# Altium schematic sheet Sheet2.SchDoc
size A4; SheetNumber: 1; SheetTotal: 1
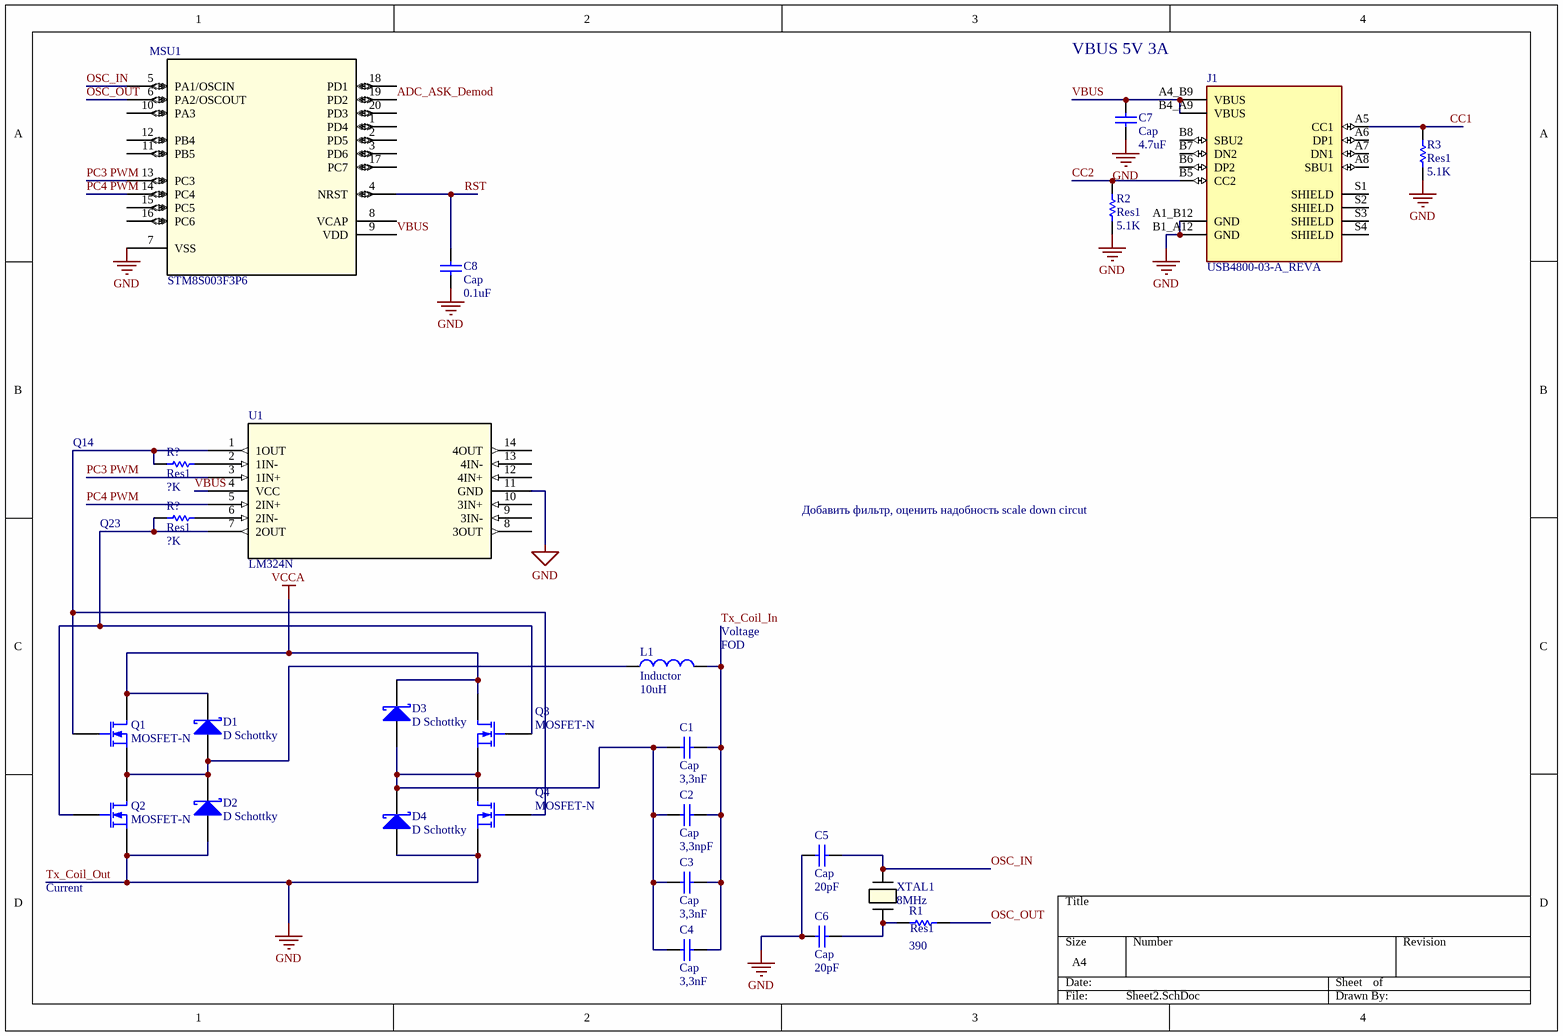
[diagram p0: Sheet2.SchDoc]

## Parts
(Parts that share a designator on the sheet are numbered #1, #2 ... from top to bottom, then left to right.)
C1  Cap  value 3,3nF  [RAD-0.3]
C2  Cap  value 3,3npF  [RAD-0.3]
C3  Cap  value 3,3nF  [RAD-0.3]
C4  Cap  value 3,3nF  [RAD-0.3]
C5  Cap  value 20pF  [RAD-0.3]
C6  Cap  value 20pF  [RAD-0.3]
C7  Cap  value 4.7uF  [RAD-0.3]
C8  Cap  value 0.1uF  [RAD-0.3]
D1  D Schottky  [SMB]
D2  D Schottky  [SMB]
D3  D Schottky  [SMB]
D4  D Schottky  [SMB]
J1  USB4800-03-A_REVA  [GCT_USB4800-03-A_REVA]
L1  Inductor  value 10uH  [0402-A]
MSU1  STM8S003F3P6  [TSSOP20]
Q1  MOSFET-N  [E3]
Q2  MOSFET-N  [E3]
Q3  MOSFET-N  [E3]
Q4  MOSFET-N  [E3]
R1  Res1  value 390  [AXIAL-0.3]
R2  Res1  value 5.1K  [AXIAL-0.3]
R3  Res1  value 5.1K  [AXIAL-0.3]
R?#1  Res1  value ?K  [AXIAL-0.3]
R?#2  Res1  value ?K  [AXIAL-0.3]
U1  LM324N  [N14]
XTAL1  8MHz  [CRYSTAL_ECS-80-18-5PX-TR_ECS]

## Nets
Tx_Coil_Out: C5.2 C6.2 C7.1 C8.1 D2.1(A) D4.1(A) J1.A1_B12(GND) J1.B1_A12(GND) MSU1.7(VSS) Q2.3(S) Q4.3(S) R2.2 R3.2 U1.11(GND)  [also labelled GND]
VCCA: D1.2(K) D3.2(K) Q1.1(D) Q3.1(D)
ADC_ASK_Demod: MSU1.19(PD2)
CC1: J1.A5(CC1) R3.1
CC2: J1.B5(CC2) R2.1
OSC_IN: C5.1 MSU1.5(PA1/OSCIN) XTAL1.1
OSC_OUT: MSU1.6(PA2/OSCOUT) R1.2
PC3 PWM: MSU1.13(PC3) U1.3(1IN+)
PC4 PWM: MSU1.14(PC4) U1.5(2IN+)
RST: C8.2 MSU1.4(NRST)
Tx_Coil_In: C1.2 C2.2 C3.2 C4.2 L1.2
VBUS: C7.2 J1.A4_B9(VBUS) J1.B4_A9(VBUS) MSU1.9(VDD) U1.4(VCC)
NetC1_1: C1.1 C2.1 C3.1 C4.1 D3.1(A) D4.2(K) Q3.3(S) Q4.1(D)
NetC6_1: C6.1 R1.1 XTAL1.2
NetD1_1: D1.1(A) D2.2(K) L1.1 Q1.3(S) Q2.1(D)
NetQ1_2: Q1.2(G) Q4.2(G) R?#1.1 U1.1(1OUT)
NetQ2_2: Q2.2(G) Q3.2(G) R?#2.1 U1.7(2OUT)
NetR?#1_2: R?#1.2 U1.2(1IN-)
NetR?#2_2: R?#2.2 U1.6(2IN-)

Not connected (* = marked no-connect by the designer): J1 A6(DP1) A7(DN1) A8(SBU1) B6(DP2) B7(DN2) B8(SBU2) S1(SHIELD) S2(SHIELD) S3(SHIELD) S4(SHIELD); MSU1 1(PD4) 2(PD5) 3(PD6) 8(VCAP) 10(PA3) 11(PB5) 12(PB4) 15(PC5) 16(PC6) 17(PC7) 18(PD1) 20(PD3); U1 8(3OUT) 9(3IN-) 10(3IN+) 12(4IN+) 13(4IN-) 14(4OUT)

## Notes on the sheet
- VBUS 5V 3A
- Q14
- Добавить фильтр, оценить надобность scale down circut
- (near R?#2) Q23
- (near L1) Voltage
- (near L1) FOD
- Current

## Library data of the parts
C1-C8 = Cap: Capacitor; Published: 8-Jun-2000; LatestRevisionDate: 17-Jul-2002; LatestRevisionNote: Re-released for DXP Platform.; PackageReference: RAD-0.3; Publisher: Altium Limited; PackageDescription: Radial Cap, Thru-Hole; 2 Leads; 0.3 in Pin Spacing
D1-D4 = D Schottky: Schottky Diode; Published: 8-Jun-2000; LatestRevisionDate: 17-Jul-2002; LatestRevisionNote: Re-released for DXP Platform.; PackageReference: SMB; Publisher: Altium Limited; PackageDescription: DO-214-AA/SMB; 2 C-Bend Leads; Body 5.3 x 3.6 mm, inc. leads (LxW); Code_JEDEC: DO-214-AA
J1 = USB4800-03-A_REVA: USB-C (USB TYPE-C) USB 2.0 Receptacle Connector 24 (16+8 Dummy) Position Surface Mount, Right Angle; Through Hole; MF: Global Connector Technology; SnapEDA_Link: https://www.snapeda.com/parts/USB4800-03-A/Global+Connector+Technology/view-part/?ref=snap; Package: None; MP: USB4800-03-A; Check_prices: https://www.snapeda.com/parts/USB4800-03-A/Global+Connector+Technology/view-part/?ref=eda; Purchase-URL: https://pricing.snapeda.com/search/part/USB4800-03-A/?ref=eda; Price: None; Value: *; Availability: In Stock
L1 = Inductor: Code_IEC: 1005; Published: 8-Jun-2000; LatestRevisionDate: 29-May-2009; LatestRevisionNote: IPC-7351 Footprint Added.; PackageReference: 0402-A; Publisher: Altium Limited; PackageDescription: Chip Inductor; Code_JEITA: 0402
MSU1 = STM8S003F3P6: No Description Available; Mfr_Name: STMicroelectronics; RefDes: RefDes; Type: Type
Q1-Q4 = MOSFET-N: N-Channel MOSFET; Published: 8-Jun-2000; LatestRevisionDate: 17-Jul-2002; LatestRevisionNote: Re-released for DXP Platform.; PackageVersion: 1995/1996; PackageReference: E3; Publisher: Altium Limited; PackageDescription: TO, Flat Index; 3 In-Line, Axial Leads; Body Dia. 4.6mm; Lead Dia. 0.5 mm (max)
R1-R3 R?#1 R?#2 = Res1: Resistor; Published: 8-Jun-2000; LatestRevisionDate: 17-Jul-2002; LatestRevisionNote: Re-released for DXP Platform.; PackageReference: AXIAL-0.3; Publisher: Altium Limited; PackageDescription: Axial Device, Thru-Hole; 2 Leads; 0.3 in Pin Spacing
U1 = LM324N: No Description Available; Mfr_Name: Texas Instruments; RefDes: RefDes; Type: Type
XTAL1 = ECS-80-18-5PX-TR: No Description Available; Mfr_Name: ECS International